# Altium project Design 4 - Surface Mount Board.PrjPcb
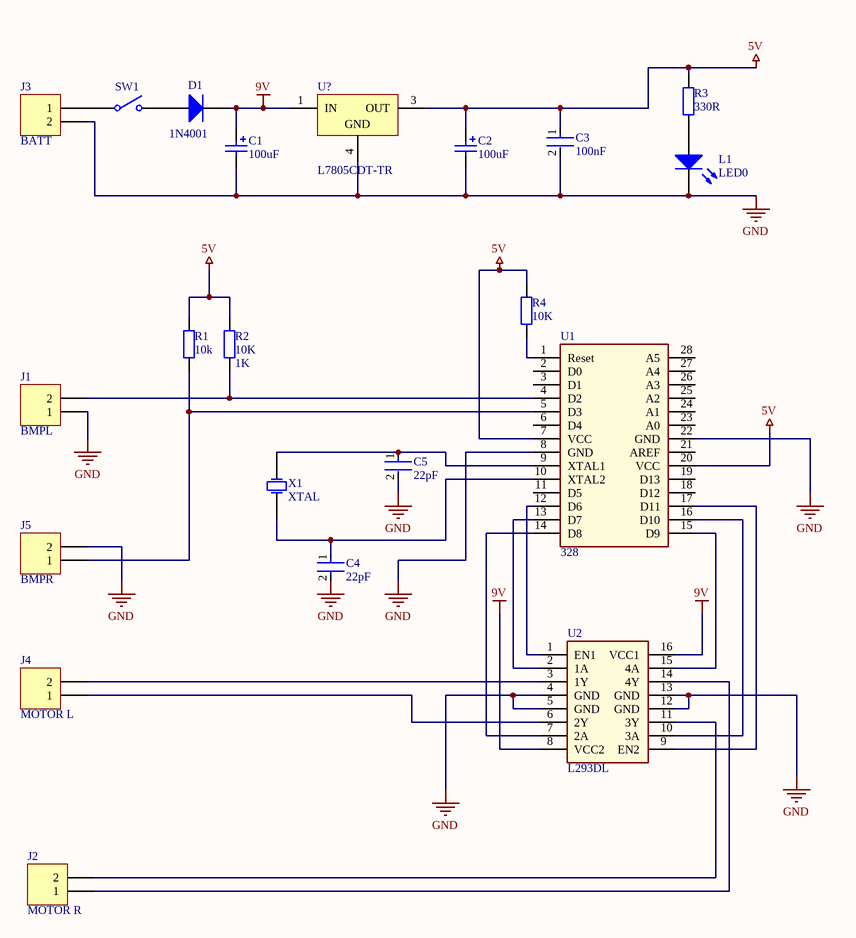
[diagram p0: STRIP BOARD.SchDoc]
1 sheet, 21 parts. Net scope: global (net labels, ports and power ports of the same name join across sheets).
Board file: Design Exercise 4 - Surface Mount Board.PcbDoc

## Sheet STRIP BOARD.SchDoc
size A3; SheetNumber: 1; SheetTotal: 1

### Parts
C1  100uF  [SM_RADIAL_6.3BMM]
C2  100uF  [SM_RADIAL_6.3BMM]
C3  100nF  [FP-GRM033-0_03-MFG]
C4  22pF  [FP-GRM033-0_03-MFG]
C5  22pF  [FP-GRM033-0_03-MFG]
D1  1N4001  [SOD-123]
J1  BMPL  [2 PIN HEADER]
J2  MOTOR R  [2 PIN HEADER]
J3  BATT  [2 PIN HEADER]
J4  MOTOR L  [2 PIN HEADER]
J5  BMPR  [2 PIN HEADER]
L1  LED0  [LED_0603]
R1  10k  [1210]
R2  10K  value 1K  [1210]
R3  330R  [1210]
R4  10K  [1210]
SW1  SW-SPST  [2 PIN HEADER]  (value not drawn)
U1  328  [TSQFP50P700X700X120-32N]
U2  L293DL  [L293]
U?  L7805CDT-TR  [TO-252_N]
X1  XTAL  [Crystal Oscilator]

### Nets
5V: C2.1 C3.1 R1.2 R2.2 R3.2 R4.2 U1.7(VCC) U1.20(VCC) U?.3(OUT)
9V: C1.1 D1.2(K) U2.8(VCC2) U2.16(VCC1) U?.1(IN)
GND: C1.2 C2.2 C3.2 C4.2 C5.2 J1.1 J3.2 J5.2 L1.2(K) U1.8(GND) U1.22(GND) U2.4(GND) U2.5(GND) U2.12(GND) U2.13(GND) U?.4(GND)
NetC4_1: C4.1 U1.10(XTAL2) X1.1(OSC1)
NetC5_1: C5.1 U1.9(XTAL1) X1.2(OSC2)
NetJ1_2: J1.2 R2.1 U1.4(D2)
NetJ2_1: J2.1 U2.14(4Y)
NetJ2_2: J2.2 U2.11(3Y)
NetJ3_1: J3.1 SW1.1(COMMON)
NetJ4_1: J4.1 U2.6(2Y)
NetJ4_2: J4.2 U2.3(1Y)
NetJ5_1: J5.1 R1.1 U1.5(D3)
NetL1_1: L1.1(A) R3.1
NetR4_1: R4.1 U1.1(Reset)
NetU1_12: U1.12(D6) U2.1(EN1)
NetU1_13: U1.13(D7) U2.2(1A)
NetU1_14: U1.14(D8) U2.7(2A)
NetU1_15: U1.15(D9) U2.15(4A)
NetU1_16: U1.16(D10) U2.10(3A)
NetU1_17: U1.17(D11) U2.9(EN2)

Not connected (* = marked no-connect by the designer): D1 1(A); SW1 2(NO); U1 2(D0) 3(D1) 6(D4) 11(D5) 18(D12) 19(D13) 21(AREF) 23(A0) 24(A1) 25(A2) 26(A3) 27(A4) 28(A5)

### Library data of the parts
C1 C2 = Cap Pol2: Polarized Capacitor (Axial); Value: 100pF; Published: 8-Jun-2000; LatestRevisionDate: 17-Jul-2002; LatestRevisionNote: Re-released for DXP Platform.; PackageReference: POLAR0.8; Publisher: Altium Limited; PackageDescription: Polarized Capacitor; 2 Leads
C3-C5 = CMP-06035-050511-1: Chip Multilayer Ceramic Capacitors for General Purpose, 0201, 4.0pF, C0G, 30ppm/°C, 0.25pF, 100V; Capacitance: 4pF; Case Code (Imperial): 0201; Package Quantity: 15000; Case Code (Metric): 0603; Thickness: 0.013inch; Packaging: Tape and Reel; Case/Package: 0201; Max Operating Temperature: 125°C; Width: 0.3mm; Weight: 1.2E-05oz; Mount: Surface Mount; Dielectric: C0G; Length: 0.024inch; Voltage Rating: 100V; Voltage Rating (DC): 100V; Min Operating Temperature: -55°C; Height: 0.3mm; Termination: SMD/SMT
D1 = Diode 1N4001: 1 Amp General Purpose Rectifier; Published: 8-Jun-2000; LatestRevisionDate: 17-Jul-2002; LatestRevisionNote: Re-released for DXP Platform.; DatasheetVersion: 1998; PackageVersion: Aug-1999; PackageReference: DO-41; Publisher: Altium Limited; PackageDescription: Diode, Axial; Body 5.2 x 2.7 mm (LxDia. max), Lead Dia. 0.86 mm (max); Code_JEDEC: DO-204-AL; ComponentLink1Description: Manufacturer Link; ComponentLink1URL: http://www.fairchildsemi.com/; ComponentLink2Description: Datasheet; ComponentLink2URL: http://www.fairchildsemi.com/ds/1N%2F1N4001.pdf
J1-J5 = Header 2: Header, 2-Pin; LatestRevisionDate: 17-Jul-2002; LatestRevisionNote: Re-released for DXP Platform.; Publisher: Altium Limited
L1 = LED0: Typical INFRARED GaAs LED; Published: 8-Jun-2000; LatestRevisionDate: 08-Jul-2005; LatestRevisionNote: Mech Layer 1 removed.; PackageReference: LED-0; Publisher: Altium Limited; PackageDescription: LED; 2 Leads
R1 R3 R4 = Res2: Resistor; Value: 1K; Published: 8-Jun-2000; LatestRevisionDate: 17-Jul-2002; LatestRevisionNote: Re-released for DXP Platform.; PackageReference: AXIAL-0.4; Publisher: Altium Limited; PackageDescription: Axial Device, Thru-Hole; 2 Leads; 0.4 in Pin Spacing
R2 = Res2: Resistor; Published: 8-Jun-2000; LatestRevisionDate: 17-Jul-2002; LatestRevisionNote: Re-released for DXP Platform.; PackageReference: AXIAL-0.4; Publisher: Altium Limited; PackageDescription: Axial Device, Thru-Hole; 2 Leads; 0.4 in Pin Spacing
SW1 = SW-SPST: Single-Pole, Single-Throw Switch; Published: 24-Mar-1999; LatestRevisionDate: 17-Jul-2002; LatestRevisionNote: Re-released for DXP Platform.; PackageReference: SPST-2; Publisher: Altium Limited; PackageDescription: Switch; 2 Leads
U1 = Atmega 168
U? = CMP-0244-00216-1: Positive Voltage Regulator, 3-Pin DPAK, Tape and Reel; PackageVersion: 2011; PackageReference: TO-252; DatasheetVersion: 16/11/2011; PackageDescription: 3-Pin Transistor Outline Package 2.28 mm Pitch, 9.7 mm Lead Span (DPAK); ComponentLink1URL: http://www.st.com; ComponentLink2Description: Datasheet; ComponentLink1Description: Manufacturer URL; ComponentLink2URL: http://www.st.com/internet/com/TECHNICAL_RESOURCES/TECHNICAL_LITERATURE/DATASHEET/CD00000444.pdf
X1 = XTAL: Crystal Oscillator; Published: 8-Jun-2000; LatestRevisionDate: 17-Jul-2002; LatestRevisionNote: Re-released for DXP Platform.; PackageReference: R38; Publisher: Altium Limited; PackageDescription: Crystal, Thru-Hole; 2 Leads; Body 3.1 x 8.2 mm (Dia.xH)